# Altium schematic sheet adcIn.SchDoc
size A4
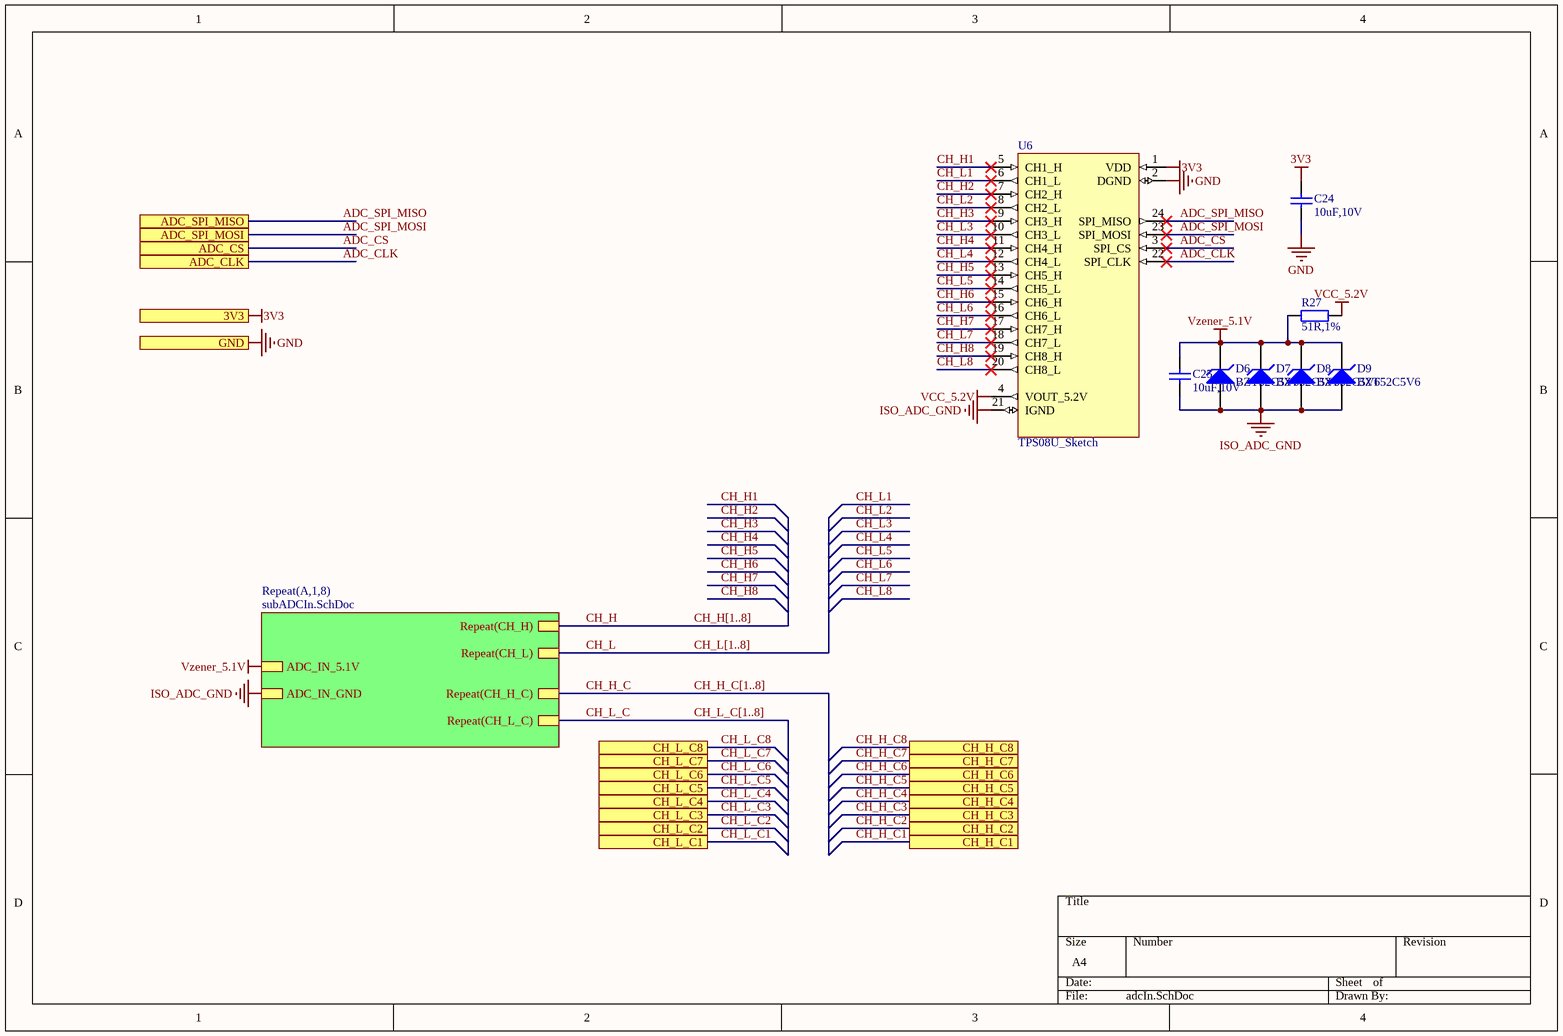
[diagram p0: adcIn.SchDoc]

## Parts
C24  10uF,10V  [C0603]
C25  10uF,10V  [C0603]
D6  BZT52C5V6  [SOD-123]
D7  BZT52C5V6  [SOD-123]
D8  BZT52C5V6  [SOD-123]
D9  BZT52C5V6  [SOD-123]
R27  51R,1%  [R0603]
U6  TPS08U_Sketch  [TPS08U]

## Sub-sheets
Repeat(A,1,8) = subADCIn.SchDoc: Repeat(CH_H), Repeat(CH_L), ADC_IN_5.1V, ADC_IN_GND, Repeat(CH_L_C), Repeat(CH_H_C)

## Ports
3V3, ADC_CLK, ADC_CS, ADC_SPI_MISO, ADC_SPI_MOSI, CH_H_C1, CH_H_C2, CH_H_C3, CH_H_C4, CH_H_C5, CH_H_C6, CH_H_C7, CH_H_C8, CH_L_C1, CH_L_C2, CH_L_C3, CH_L_C4, CH_L_C5, CH_L_C6, CH_L_C7, CH_L_C8, GND

## Nets
3V3: C24.1 U6.1(VDD) ; port 3V3
GND: C24.2 U6.2(DGND) ; port GND
ISO_ADC_GND: C25.2 D6.1(A) D7.1(A) D8.1(A) D9.1(A) U6.21(IGND) ; sheet Repeat(A,1,8)/ADC_IN_GND
VCC_5.2V: R27.1 U6.4(VOUT_5.2V)
Vzener_5.1V: C25.1 D6.2(K) D7.2(K) D8.2(K) D9.2(K) R27.2 ; sheet Repeat(A,1,8)/ADC_IN_5.1V
ADC_CLK: U6.22(SPI_CLK) ; port ADC_CLK
ADC_CS: U6.3(SPI_CS) ; port ADC_CS
ADC_SPI_MISO: U6.24(SPI_MISO) ; port ADC_SPI_MISO
ADC_SPI_MOSI: U6.23(SPI_MOSI) ; port ADC_SPI_MOSI
CH_H: sheet Repeat(A,1,8)/Repeat(CH_H)
CH_H1: U6.5(CH1_H)
CH_H2: U6.7(CH2_H)
CH_H3: U6.9(CH3_H)
CH_H4: U6.11(CH4_H)
CH_H5: U6.13(CH5_H)
CH_H6: U6.15(CH6_H)
CH_H7: U6.17(CH7_H)
CH_H8: U6.19(CH8_H)
CH_H_C: sheet Repeat(A,1,8)/Repeat(CH_H_C)
CH_H_C1: port CH_H_C1
CH_H_C2: port CH_H_C2
CH_H_C3: port CH_H_C3
CH_H_C4: port CH_H_C4
CH_H_C5: port CH_H_C5
CH_H_C6: port CH_H_C6
CH_H_C7: port CH_H_C7
CH_H_C8: port CH_H_C8
CH_L: sheet Repeat(A,1,8)/Repeat(CH_L)
CH_L1: U6.6(CH1_L)
CH_L2: U6.8(CH2_L)
CH_L3: U6.10(CH3_L)
CH_L4: U6.12(CH4_L)
CH_L5: U6.14(CH5_L)
CH_L6: U6.16(CH6_L)
CH_L7: U6.18(CH7_L)
CH_L8: U6.20(CH8_L)
CH_L_C: sheet Repeat(A,1,8)/Repeat(CH_L_C)
CH_L_C1: port CH_L_C1
CH_L_C2: port CH_L_C2
CH_L_C3: port CH_L_C3
CH_L_C4: port CH_L_C4
CH_L_C5: port CH_L_C5
CH_L_C6: port CH_L_C6
CH_L_C7: port CH_L_C7
CH_L_C8: port CH_L_C8

## Buses and harness runs
bus CH_H[1..8]
bus CH_H_C[1..8]
bus CH_L[1..8]
bus CH_L_C[1..8]

## Library data of the parts
C24 C25 = CAP: Capacitor; Fitted: True
D6-D9 = BZT52C5V6: Surface Mount Zener Diode; Published: 8-Jun-2000; LatestRevisionDate: 17-Jul-2002; LatestRevisionNote: Re-released for DXP Platform.; DatasheetDocument: REV. L-2; PackageReference: SOD-123; Publisher: Altium Limited; ComponentLink1Description: Manufacturer Link; ComponentLink1URL: http://www.vishay.com/
R27 = 电阻: Value: 3.3K, 10%; Type: 贴片电阻